# Altium schematic sheet Line_Follower_v4.SchDoc: Line Follower
size A3; Autor: Teodor; Dopisek: Cel:; Cel: Ehh; Projektant: Teodor; Author: Teodor; DocumentNumber: 1; SheetNumber: 1; SheetTotal: 1; PROJECT CODE: LF_01
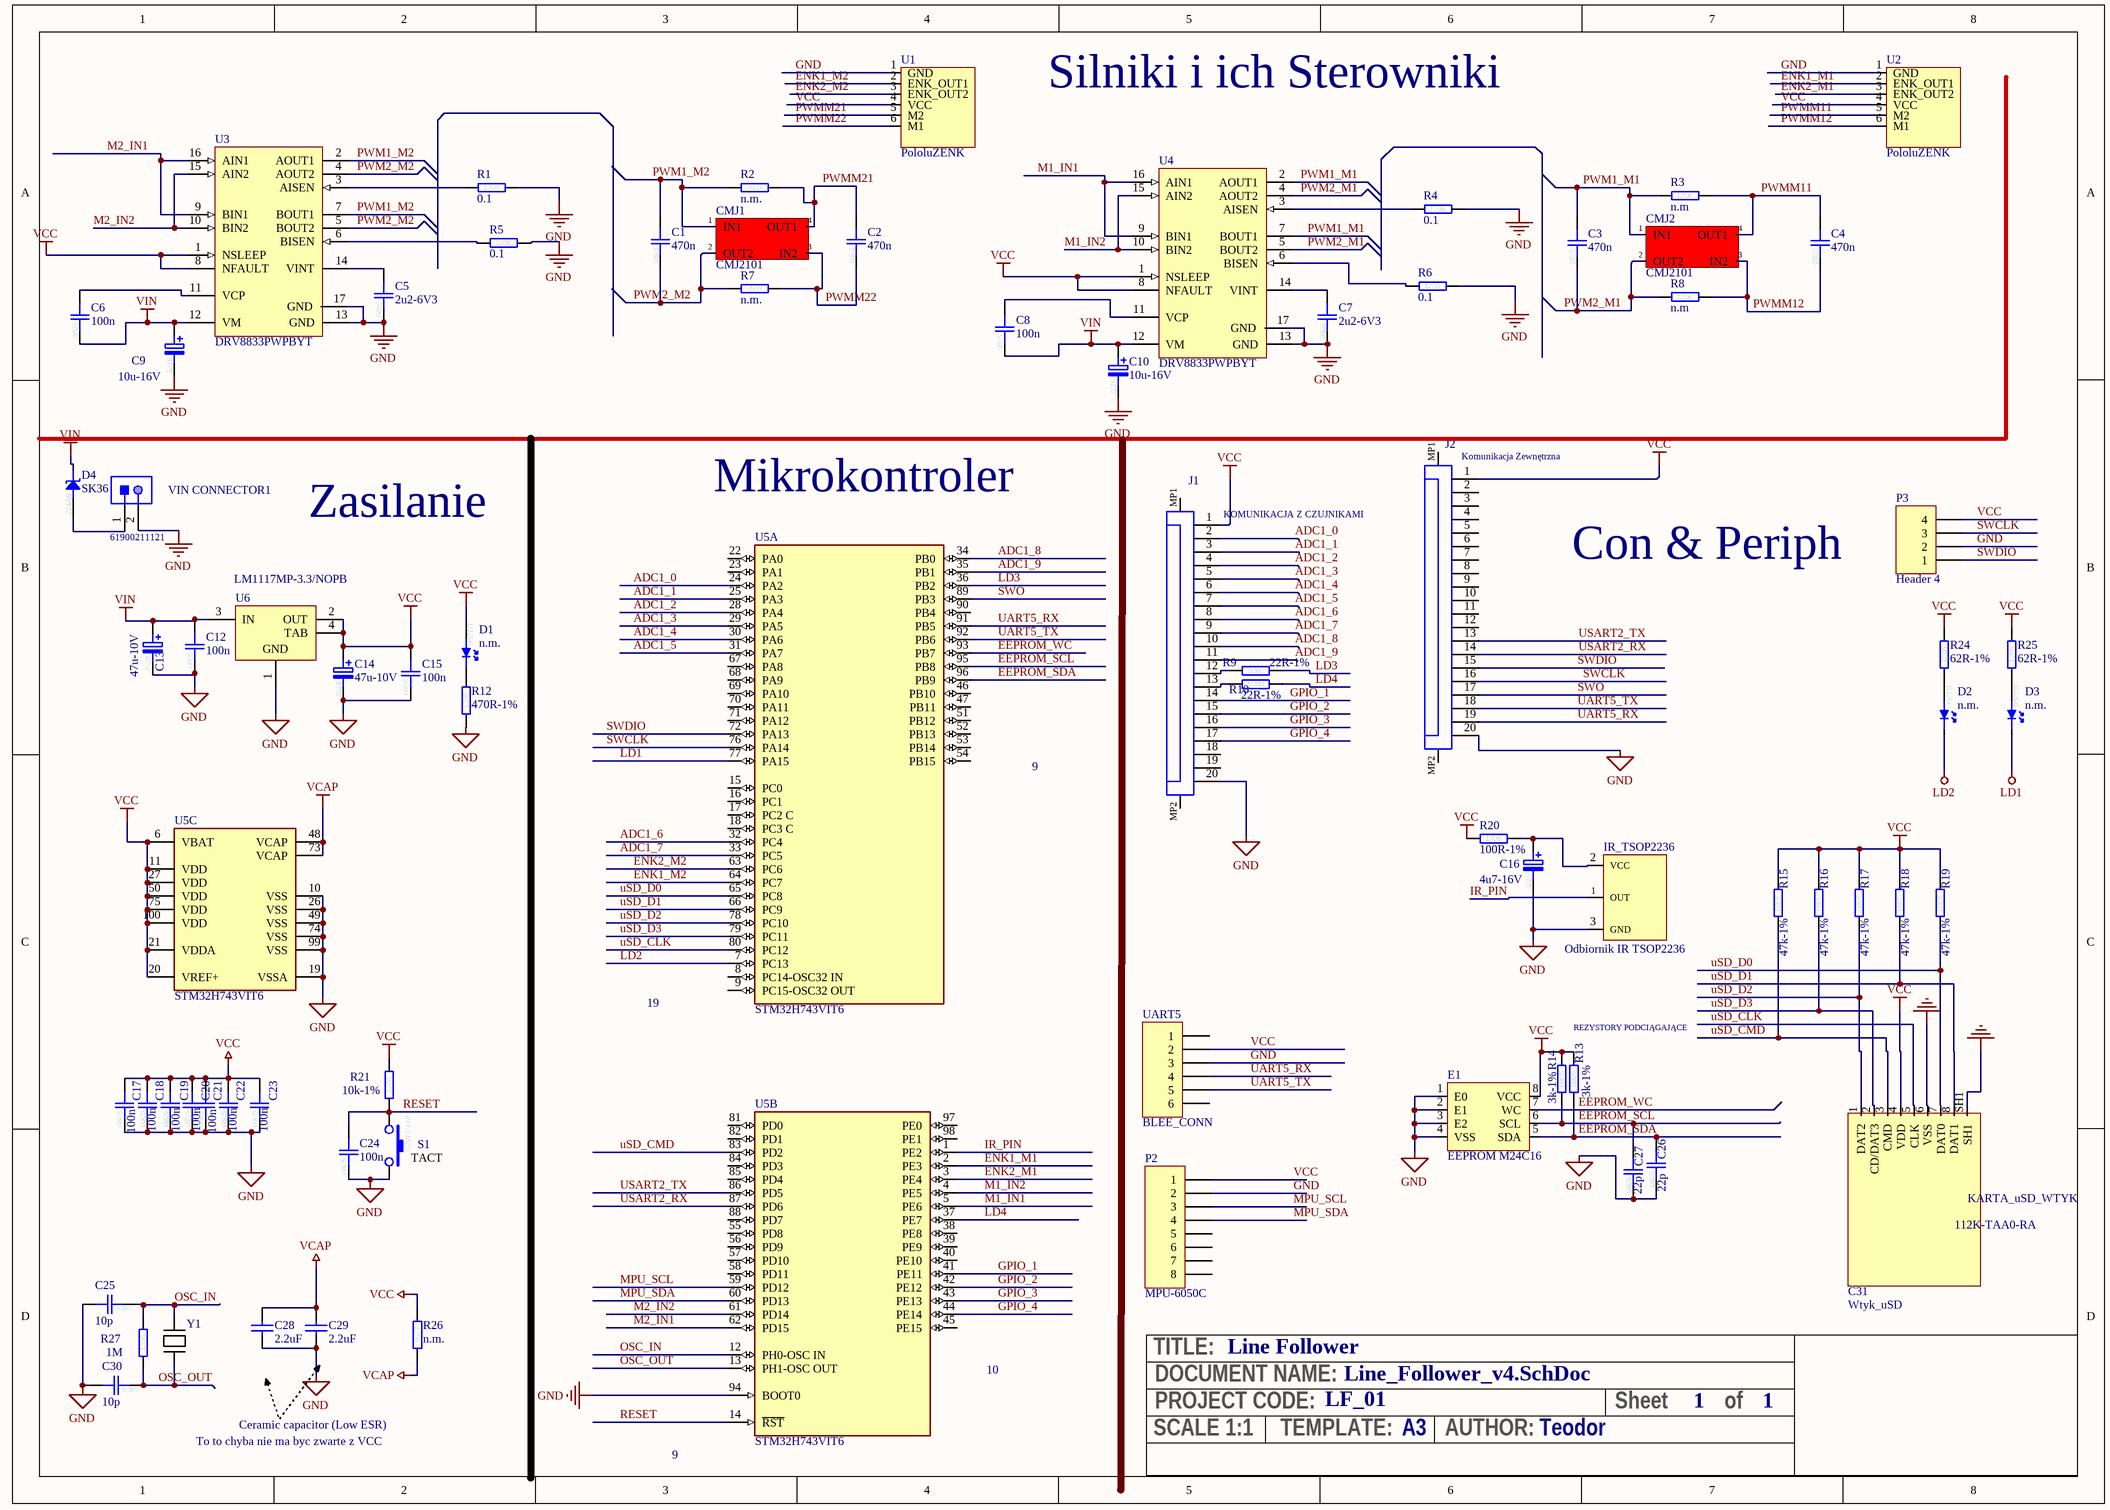
[diagram p0: Line_Follower_v4.SchDoc]

## Parts
C1  470n  [0805C]
C2  470n  [0805C]
C3  470n  [0805C]
C4  470n  [0805C]
C5  2u2-6V3  [0805C]
C6  100n  [0805C]
C7  2u2-6V3  [0805C]
C8  100n  [0805C]
C9  10u-16V  [3216-SMDA]
C10  10u-16V  [3216-SMDA]
C12  100n  [0805C]
C13  47u-10V  [3528-SMDB]
C14  47u-10V  [3528-SMDB]
C15  100n  [0805C]
C16  4u7-16V  [3216-SMDA]
C17  100n  [0805C]
C18  100n  [0805C]
C19  100n  [0805C]
C20  100n  [0805C]
C21  100n  [0805C]
C22  100n  [0805C]
C23  100n  [0805C]
C24  100n  [0805C]
C25  10p  [0805C]
C26  22p  [0805C]
C27  22p  [0805C]
C28  2.2uF  [1206C]
C29  2.2uF  [1206C]
C30  10p  [0805C]
C31  Wtyk_uSD  [112K-TAA0-RA1]
CMJ1  CMJ2101  [CMJ2101FP]
CMJ2  CMJ2101  [CMJ2101FP]
D1  n.m.  [D1206]  (no BOM)
D2  n.m.  [D1206]  (no BOM)
D3  n.m.  [D1206]  (no BOM)
D4  SK36  [DO214AB]
E1  EEPROM M24C16  [SOP8EEPROM]
IR_TSOP2236  Odbiornik IR TSOP2236  [TSOP2236FP]
J1  KOMUNIKACJA Z CZUJNIKAMI  [687120183722]
J2  Komunikacja Zewnętrzna  [687120183722]
P2  MPU-6050C  [HDR1X8]
P3  Header 4  [HDR1X4]
R1  0.1  [1206R]
R2  n.m.  [0603R]  (no BOM)
R3  n.m  [1206R]
R4  0.1  [1206R]
R5  0.1  [1206R]
R6  0.1  [1206R]
R7  n.m.  [0603R]  (no BOM)
R8  n.m  [1206R]
R9  22R-1%  [0805R]
R10  22R-1%  [0805R]
R12  470R-1%  [1206R]
R13  3k-1%  [0805R]
R14  3k-1%  [0805R]
R15  47k-1%  [0805R]
R16  47k-1%  [0805R]
R17  47k-1%  [0805R]
R18  47k-1%  [0805R]
R19  47k-1%  [0805R]
R20  100R-1%  [1206R]
R21  10k-1%  [1206R]
R24  62R-1%  [1206R]
R25  62R-1%  [1206R]
R26  n.m.  [1206R]  (no BOM)
R27  1M  [1206R]
S1  TACT  [INT-1187S_16]
U1  PololuZENK  [PololuzENK]
U2  PololuZENK  [PololuzENK]
U3  DRV8833PWPBYT  [DRV8833PWPBYTEOR]
U4  DRV8833PWPBYT  [DRV8833PWPBYTEOR]
U5  STM32H743VIT6  [FP-LQFP100-1L-MFG]  (parts A,B,C of 3)
U6  LM1117MP-3.3/NOPB  [DCY0004A_L]
UART5  BLEE_CONN  [HDR1X6]
VIN_CONNECTOR1  61900211121  [61900211121]
Y1  Rezonator_z_Botland  [Rezonator_z_Botlandu]  (value not drawn)

## Nets
GND: C5.2 C7.2 C9.2 C10.2 C12.2 C13.2 C14.2 C15.2 C16.2 C17.2 C18.2 C19.2 C20.2 C21.2 C22.2 C23.2 C24.2 C25.1 C26.2 C27.2 C28.1 C29.1 C30.1 C31.6(VSS) C31.SH1 E1.1(E0) E1.2(E1) E1.3(E2) E1.4(VSS) IR_TSOP2236.3(GND) J1.20 J2.20 P2.2 P3.2 R1.2 R4.2 R5.2 R6.2 R12.2 S1.2 U1.1(GND) U2.1(GND) U3.13(GND) U3.17(GND) U4.13(GND) U4.17(GND) U5.10(VSS) U5.19(VSSA) U5.26(VSS) U5.49(VSS) U5.74(VSS) U5.94(BOOT0) U5.99(VSS) U6.1(GND) UART5.3 VIN_CONNECTOR1.2
LD1: D3.1(K) U5.77(PA15)
LD2: D2.1(K) U5.7(PC13)
VCAP: C28.2 C29.2 R26.1 U5.48(VCAP) U5.73(VCAP)
VCC: C14.1 C15.1 C17.1 C18.1 C19.1 C20.1 C21.1 C22.1 C23.1 C31.4(VDD) D1.2(A) E1.8(VCC) J1.1 J2.1 P2.1 P3.4 R13.1 R14.1 R15.1 R16.1 R17.1 R18.1 R19.1 R20.1 R21.1 R24.1 R25.1 R26.2 U1.4(VCC) U2.4(VCC) U3.1(NSLEEP) U3.8(NFAULT) U4.1(NSLEEP) U4.8(NFAULT) U5.6(VBAT) U5.11(VDD) U5.20(VREF+) U5.21(VDDA) U5.27(VDD) U5.50(VDD) U5.75(VDD) U5.100(VDD) U6.2(OUT) U6.4(TAB) UART5.2
VIN: C6.2 C8.2 C9.1 C10.1 C12.1 C13.1 D4.1(K) U3.12(VM) U4.12(VM) U6.3(IN)
ADC1_0: J1.2 U5.24(PA2)
ADC1_1: J1.3 U5.25(PA3)
ADC1_2: J1.4 U5.28(PA4)
ADC1_3: J1.5 U5.29(PA5)
ADC1_4: J1.6 U5.30(PA6)
ADC1_5: J1.7 U5.31(PA7)
ADC1_6: J1.8 U5.32(PC4)
ADC1_7: J1.9 U5.33(PC5)
ADC1_8: J1.10 U5.34(PB0)
ADC1_9: J1.11 U5.35(PB1)
EEPROM_SCL: C27.1 E1.6(SCL) R14.2 U5.95(PB8)
EEPROM_SDA: C26.1 E1.5(SDA) R13.2 U5.96(PB9)
EEPROM_WC: E1.7(WC) U5.93(PB7)
ENK1_M1: U2.2(ENK_OUT1) U5.2(PE3)
ENK1_M2: U1.2(ENK_OUT1) U5.64(PC7)
ENK2_M1: U2.3(ENK_OUT2) U5.3(PE4)
ENK2_M2: U1.3(ENK_OUT2) U5.63(PC6)
GPIO_1: J1.14 U5.41(PE11)
GPIO_2: J1.15 U5.42(PE12)
GPIO_3: J1.16 U5.43(PE13)
GPIO_4: J1.17 U5.44(PE14)
IR_PIN: IR_TSOP2236.1(OUT) U5.1(PE2)
LD3: R9.2 U5.36(PB2)
LD4: R10.2 U5.37(PE7)
M1_IN1: U4.9(BIN1) U4.16(AIN1) U5.5(PE6)
M1_IN2: U4.10(BIN2) U4.15(AIN2) U5.4(PE5)
M2_IN1: U3.9(BIN1) U3.16(AIN1) U5.62(PD15)
M2_IN2: U3.10(BIN2) U3.15(AIN2) U5.61(PD14)
MPU_SCL: P2.3 U5.59(PD12)
MPU_SDA: P2.4 U5.60(PD13)
OSC_IN: C25.2 R27.2 U5.12(PH0-OSC_IN) Y1.1
OSC_OUT: C30.2 R27.1 U5.13(PH1-OSC_OUT) Y1.2
PWM1_M1: C3.1 CMJ2.1(IN1) R3.1 U4.2(AOUT1) U4.7(BOUT1)
PWM1_M2: C1.1 CMJ1.1(IN1) R2.1 U3.2(AOUT1) U3.7(BOUT1)
PWM2_M1: C3.2 CMJ2.2(OUT2) R8.1 U4.4(AOUT2) U4.5(BOUT2)
PWM2_M2: C1.2 CMJ1.2(OUT2) R7.1 U3.4(AOUT2) U3.5(BOUT2)
PWMM11: C4.1 CMJ2.4(OUT1) R3.2 U2.5(M2)
PWMM12: C4.2 CMJ2.3(IN2) R8.2 U2.6(M1)
PWMM21: C2.1 CMJ1.4(OUT1) R2.2 U1.5(M2)
PWMM22: C2.2 CMJ1.3(IN2) R7.2 U1.6(M1)
RESET: C24.1 R21.2 S1.1 U5.14(~{RST})
SWCLK: J2.16 P3.3 U5.76(PA14)
SWDIO: J2.15 P3.1 U5.72(PA13)
SWO: J2.17 U5.89(PB3)
UART5_RX: J2.19 U5.91(PB5) UART5.4
UART5_TX: J2.18 U5.92(PB6) UART5.5
USART2_RX: J2.14 U5.87(PD6)
USART2_TX: J2.13 U5.86(PD5)
uSD_CLK: C31.5(CLK) U5.80(PC12)
uSD_CMD: C31.3(CMD) R15.2 U5.83(PD2)
uSD_D0: C31.7(DAT0) R19.2 U5.65(PC8)
uSD_D1: C31.8(DAT1) R18.2 U5.66(PC9)
uSD_D2: C31.1(DAT2) R17.2 U5.78(PC10)
uSD_D3: C31.2(CD/DAT3) R16.2 U5.79(PC11)
NetC5_1: C5.1 U3.14(VINT)
NetC6_1: C6.1 U3.11(VCP)
NetC7_1: C7.1 U4.14(VINT)
NetC8_1: C8.1 U4.11(VCP)
NetC16_1: C16.1 IR_TSOP2236.2(VCC) R20.2
NetD1_1: D1.1(K) R12.1
NetD2_2: D2.2(A) R24.2
NetD3_2: D3.2(A) R25.2
NetD4_2: D4.2(A) VIN_CONNECTOR1.1
NetJ1_12: J1.12 R9.1
NetJ1_13: J1.13 R10.1
NetR1_1: R1.1 U3.3(AISEN)
NetR4_1: R4.1 U4.3(AISEN)
NetR5_1: R5.1 U3.6(BISEN)
NetR6_1: R6.1 U4.6(BISEN)

Not connected (* = marked no-connect by the designer): J1 18 19 MP1 MP2; J2 2 3 4 5 6 7 8 9 10 11 12 MP1 MP2; P2 5 6 7 8; U5 8(PC14-OSC32_IN) 9(PC15-OSC32_OUT) 15(PC0) 16(PC1) 17(PC2_C) 18(PC3_C) 22(PA0) 23(PA1) 38(PE8) 39(PE9) 40(PE10) 45(PE15) 46(PB10) 47(PB11) 51(PB12) 52(PB13) 53(PB14) 54(PB15) 55(PD8) 56(PD9) 57(PD10) 58(PD11) 67(PA8) 68(PA9) 69(PA10) 70(PA11) 71(PA12) 81(PD0) 82(PD1) 84(PD3) 85(PD4) 88(PD7) 90(PB4) 97(PE0) 98(PE1); UART5 1 6

## Notes on the sheet
- Silniki i ich Sterowniki
- Mikrokontroler
- Zasilanie
- Con & Periph
- 9
- 19
- REZYSTORY PODCIĄGAJĄCE
- 10
- To to chyba nie ma byc zwarte z VCC
- Ceramic capacitor (Low ESR)
- TITLE:
- DOCUMENT NAME:
- SCALE 1:1
- PROJECT CODE:
- TEMPLATE:
- A3
- AUTHOR:
- Sheet
- of
- (in symbol 0R12-1%  1206) 1206
- (in symbol 2u2-6V3  0805) 0805
- (in symbol 3k-1%  0805) 0805
- (in symbol 4u7-16V  3216) 3216
- (in symbol 10k-1%  1206) 1206
- (in symbol 10n  0805) 0805
- (in symbol 10p  0805) 0805
- (in symbol 10u-16V  3216) 3216
- (in symbol 22p  0805) 0805
- (in symbol 22R-1%  0805) 0805
- (in symbol 47k-1%  0805) 0805
- (in symbol 47u-10V  3528) 3528
- (in symbol 62R-1%  1206) 1206
- (in symbol 100k-1%  1206) 1206
- (in symbol 100n  0805) 0805
- (in symbol 100R-1%  1206) 1206
- (in symbol 112K-TAA0-RA1) KARTA_uSD_WTYK; 112K-TAA0-RA
- (in symbol 470R-1%  1206) 1206
- (in symbol n.m.  0603) 0603
- (in symbol n.m.  1206) 1206
- (in symbol n.m.  D1206) D1206
- (in symbol SK36  DO214AB) 214AB
- (in symbol TACTDF52H16M250  INT-1187S_16) INT-1187S

## Library data of the parts
C1-C4 = 100n  0805: Kond. ceramiczny X7R  50V  10%; Indeks: 5566; Nazwa: 100n
C5 C7 = 2u2-6V3  0805: Kond. ceramiczny X7R  6V3  10%; Indeks: 20978; Nazwa: 2u2-6V3
C6 C8 C12 C15 C24 = 100n  0805: Kond. ceramiczny X7R  50V  10%; Indeks: 5566; Nazwa: 100n
C9 C10 = 10u-16V  3216: Kond. tantalowy  A  16V  20%; Indeks: 12471; Nazwa: 10u-16V
C13 C14 = 47u-10V  3528: Kond. tantalowy  B  10V  20%; Indeks: 4032; Nazwa: 47u-10V
C16 = 4u7-16V  3216: Kond. tantalowy  A  16V  20%; Indeks: 20462; Nazwa: 4u7-16V
C17-C23 = 10n  0805: Kond. ceramiczny X7R  50V  10%; Nazwa: 10n
C25 C30 = 10p  0805: Kond. ceramiczny NP0  50V; Nazwa: 10p
C26 C27 = 22p  0805: Kond. ceramiczny NP0  50V; Nazwa: 22p
C28 C29 = Cap_2.2uF_X7R_10%_1206: Capacitor,2.2uF,16V, X7R,10%,1206,YAGEO; Manuf_Part_1: CC1206KKX7R7BB225; Manuf_Part_2: C1206C225K4RAC; Manuf_2: KEMET; Revision: July-2002: Re-released for DXP Platform.; Value: 2.2uF; Order: CC1206KKX7R7BB225; Manuf_1: YAGEO; ECCN_US/EU: n/a
C31 = 112K-TAA0-RA1
CMJ1 CMJ2 = CMJ2101: Dlawik 100uH 500mA
D1-D3 = n.m.  D1206: Dioda LED; Index: -; Nazwa: n.m.
D4 = SK36  DO214AB: Dioda Schottky  60V  IF=3A  VF=0,75V; Index: 9145; Nazwa: SK36
IR_TSOP2236 = TSOP2236: Odbiornik Podczerwieni
J1 J2 = CMP-1502-01579-1: SMT ZIF Connectors Low Profile WR-FPC, Horizontal, Bottom Contact, pitch 0.5 mm, 20 pins; Manufacturer: Wurth Elektronik; Rated Current: 0.4A; Pin Number: 20; Withstanding Voltage: 250VAC; Contact Resistance: 30mOhm; Working Voltage: 50VAC; Pitch: 0.5mm; Package Reference: 687120183722; Publisher: WurthElektronik; Packaging: TapeandReel; Part Number: 687120183722; Operating Temperature: -25to85degC; Orientation: Horizontal; Datasheet URL: https://katalog.we-online.de/em/datasheet/687120183722.pdf; Contact Design: BottomContact; Manufacturer URL: http://www.we-online.de; Mounting Technology: SMT
P2 = Header 8: Header, 8-Pin; LatestRevisionDate: 17-Jul-2002; LatestRevisionNote: Re-released for DXP Platform.; Publisher: Altium Limited
P3 = Header 4: Header, 4-Pin; LatestRevisionDate: 17-Jul-2002; LatestRevisionNote: Re-released for DXP Platform.; Publisher: Altium Limited
R1 R3-R6 R8 = 0R12-1%  1206: Rezystor 0,25W; Nazwa: 0R12-1%
R2 R7 = n.m.  0603: Rezystor 0,063W; Indeks: -; Nazwa: n.m.
R9 R10 = 22R-1%  0805: Rezystor 0,125W; Nazwa: 22R-1%
R12 = 470R-1%  1206: Rezystor 0,25W; Nazwa: 470R-1%
R13 R14 = 3k-1%  0805: Rezystor 0,125W; Nazwa: 3k-1%
R15-R19 = 47k-1%  0805: Rezystor 0,125W; Nazwa: 47k-1%
R20 = 100R-1%  1206: Rezystor 0,25W; Nazwa: 100R-1%
R21 = 10k-1%  1206: Rezystor 0,25W; Nazwa: 10k-1%
R24 R25 = 62R-1%  1206: Rezystor 0,25W; Nazwa: 62R-1%
R26 = n.m.  1206: Rezystor 0,25W; Indeks: -; Nazwa: n.m.
R27 = 100k-1%  1206: Rezystor 0,25W; Nazwa: 100k-1%
S1 = TACTDF52H16M250  INT-1187S_16: Switch SMD h=1,6mm Innocent  INT-1187S_16; Index: 11540; Nazwa: TACTDF52H16M250
U3 U4 = DRV8833PWPBYT: Mostek caly by TEOR
U5 = CMP-12105-000050-1: IC MCU 32BIT 2MB FLASH 100LQFP; Manufacturer: STMicroelectronics; Number Of Ethernet Channels: 1; Number Of Usb Channels: 2; Number Of A/D Converters: 3; Min Supply Voltage: 1.71V; Ram Size: 1060KBytes; Number Of I2C Channels: 4; Frequency: 480MHz; Number Of Adc Channels: 36; Number Of I/Os: 82; Max Supply Voltage: 3.6V; Number Of Spi Channels: 6; Memory Size: 2MBytes; Max Junction Temp: +125°C; Core Architecture: Arm Cortex-M7; Interface: I2C,SPI,UART,USART,USB,LIN,IrDA,Ethernet,I2S,Other; Number Of Timers/Counters: 20; Data Bus Width: 32bits; Number Of Pwm Channels: 42; Number Of Uart Channels: 9; Standoff Height: 0.05mm; Device Class L1: Integrated Circuits (ICs); ComponentLink2URL: https://www.st.com/resource/en/datasheet/stm32h743vi.pdf; Automotive: No; Memory Type: FLASH; Number Of Cores: 1; Temperature Range Low: -40°C; RoHS: TRUE; Ambient Temperature Range Low: -40°C; ComponentLink2Description: Datasheet; Device Class L2: Embedded Processors and Controllers; Device Class L3: Microcontrollers; Digikey Description: IC MCU 32BIT 2MB FLASH 100LQFP; Temperature Range High: +125°C; Ambient Temperature Range High: +85°C; Package: LQFP100-1L; Temperature: -40°C to +125°C; Category: IC; Ipc Land Pattern Name: QFP50P1600X1600X160-100; Height: 1.6mm; Manufacturer Part Number: STM32H743VIT6; Octopart: https://octopart.com/stm32h743vit6-stmicroelectronics-76372527; Lead Free: Yes
U6 = CMP-0062-01638-4: 800mA Low-Dropout Linear Regulator, 4-pin SOT-223, Pb-Free; Manufacturer: Texas Instruments; CompType: LDO IC; PackageTopMarking: XYTT*N05A; High-Reliability: Y; PowerWise: N; ComponentLink1URL: http://www.ti.com/general/docs/lit/getliterature.tsp?genericPartNumber=LM1117-N&fileType=pdf; PinCount: 4; PackageDescription: Molded SOT-223, 6.50 x 3.56 x 1.6mm Body, 4 Lead, 2.3mm Pitch; Code_IPC: SOT223-4; PartNumber: LM1117MP-3.3/NOPB; Code_JEDEC: TO-261-AA; RoHS: Y; PackageReference: DCY0004A; ComponentLink1Description: Datasheet URL
UART5 = Header 6: Header, 6-Pin; LatestRevisionDate: 17-Jul-2002; LatestRevisionNote: Re-released for DXP Platform.; Publisher: Altium Limited
VIN_CONNECTOR1 = CMP-1502-00584-1: Male Locking Header WR-WTB, THT, Vertical, pitch 2.54 mm, 1 x 2 position; Manufacturer: Wurth Elektronik; Position: 1x2; Contact Resistance: 20mOhm; Working Voltage: 250VAC; Pitch: 2.54mm; Gender: Male; Part Number: 61900211121; Mounting Technology: THT; Operating Temperature: -40to105degC; Orientation: Vertical; Packaging: Bag; Package Reference: 61900211121; Manufacturer URL: http://www.we-online.de; Datasheet URL: https://katalog.we-online.de/em/datasheet/6190xx11121.pdf; Publisher: WurthElektronik